# Altium schematic sheet Regulator_Schematic.SchDoc
size A; SheetNumber: 1; SheetTotal: 1
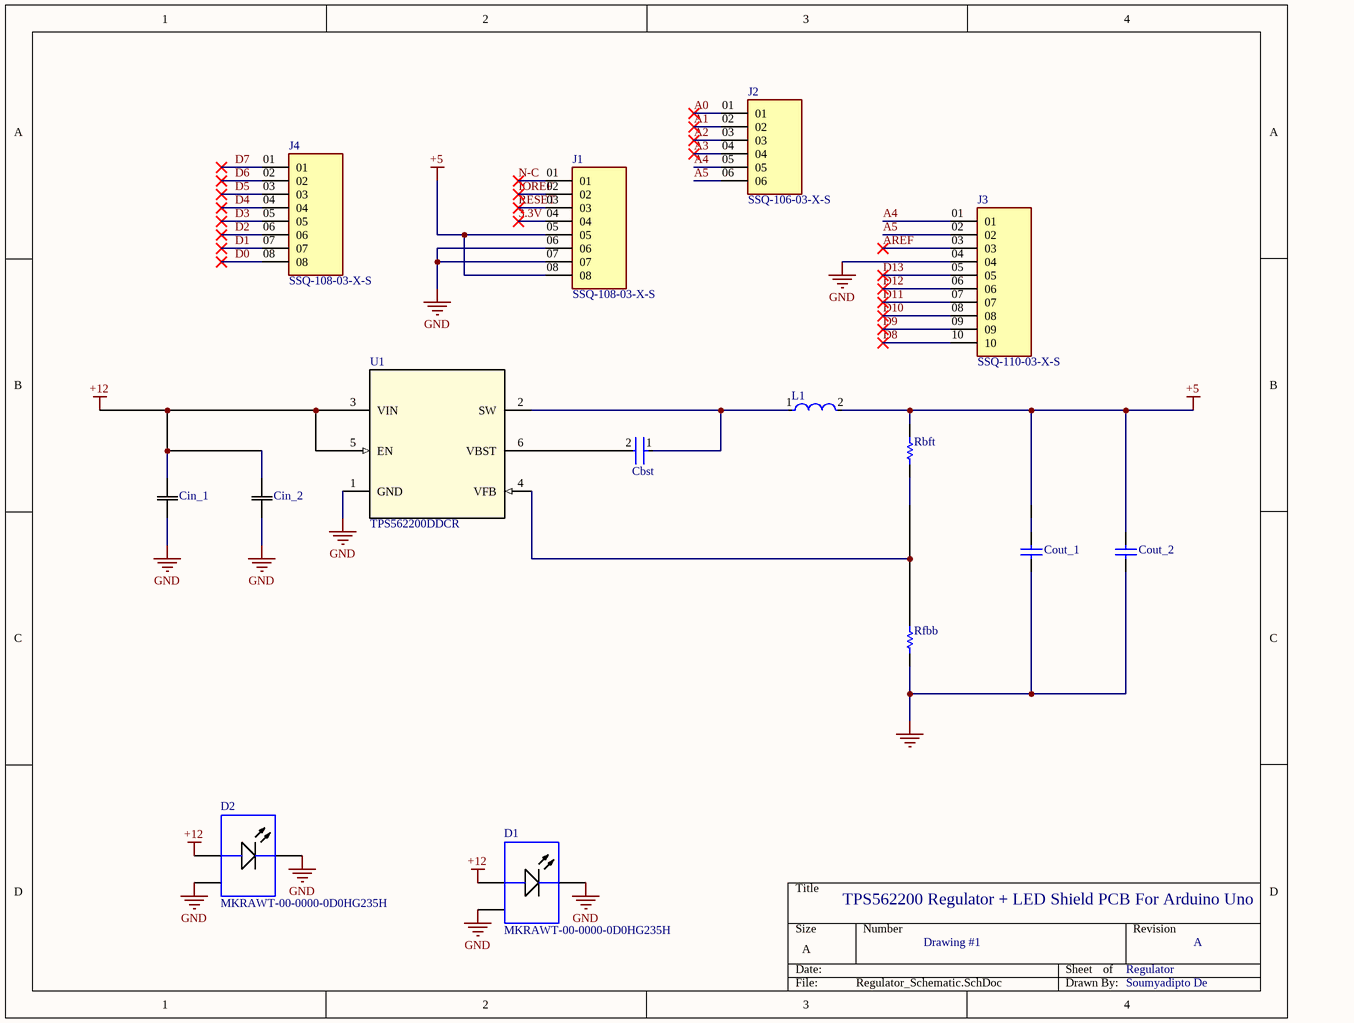
[diagram p0: Regulator_Schematic.SchDoc]

## Parts
Cbst  08053C104KAT2A  [FP-0805-L_2_01_0_2-W_1_25-IPC_C]  (value not drawn)
Cin_1  MSAST219LB5106KTNA01  [CAP_MSAS21-9_TAY]  (value not drawn)
Cin_2  MSAST219LB5106KTNA01  [CAP_MSAS21-9_TAY]  (value not drawn)
Cout_1  C1608X5R1A226M080AC  [CAPC1608X100X20ML10]  (value not drawn)
Cout_2  C1608X5R1A226M080AC  [CAPC1608X100X20ML10]  (value not drawn)
D1  MKRAWT-00-0000-0D0HG235H  [CREE-MK-R-2_V]
D2  MKRAWT-00-0000-0D0HG235H  [CREE-MK-R-2_V]
J1  SSQ-108-03-X-S  [SAMTEC_SSQ-108-03-X-S]
J2  SSQ-106-03-X-S  [SAMTEC_SSQ-106-03-X-S]
J3  SSQ-110-03-X-S  [SAMTEC_SSQ-110-03-X-S]
J4  SSQ-108-03-X-S  [SAMTEC_SSQ-108-03-X-S]
L1  NRS8030T3R3MJGJ  [FP-NRS8030-MFG]  (value not drawn)
Rbft  CRCW020156K2FNED  [RESC0603X28X15NL05T05]  (value not drawn)
Rfbb  ERJ2RKF1002X  [RESC1005X40X25LL05T05]  (value not drawn)
U1  TPS562200DDCR  [DDC0006A]

## Nets
0: Cout_1.1 Cout_2.1 Rfbb.1
+5: Cout_1.2 Cout_2.2 J1.05 J1.08 L1.2 Rbft.2
+12: Cin_1.2 Cin_2.2 D1.1(A) D2.1(A) U1.3(VIN) U1.5(EN)
GND: Cin_1.1 Cin_2.1 D1.2(K) D1.3(EP) D2.2(K) D2.3(EP) J1.06 J1.07 J3.04 U1.1(GND)
3.3V: J1.04
A0: J2.01
A1: J2.02
A2: J2.03
A3: J2.04
A4: J2.05 J3.01
A5: J2.06 J3.02
AREF: J3.03
D0: J4.08
D1: J4.07
D2: J4.06
D3: J4.05
D4: J4.04
D5: J4.03
D6: J4.02
D7: J4.01
D8: J3.10
D9: J3.09
D10: J3.08
D11: J3.07
D12: J3.06
D13: J3.05
IOREF: J1.02
N-C: J1.01
RESET: J1.03
NetCbst_1: Cbst.1 L1.1 U1.2(SW)
NetCbst_2: Cbst.2 U1.6(VBST)
NetRbft_1: Rbft.1 Rfbb.2 U1.4(VFB)

## Notes on the sheet
- TPS562200 Regulator + LED Shield PCB For Arduino Uno
- Drawing #1
- Regulator
- A
- Soumyadipto De

## Library data of the parts
Cbst = CMP-2000-05014-2: General Purpose Ceramic Capacitor, 0805, 100nF, 10%, X7R, 0.15, 25V; Dissipation Factor: 3%; Insulation Resistance: 100GR; Tolerance: 10%; Height: 0.94mm; Case/Package: 0805; Case Code (Imperial): 0805; Number of Pins: 2; Termination: SMD/SMT; Case Code (Metric): 2012; Depth: 1.25mm; Min Operating Temperature: -55°C; Radiation Hardening: No; Max Operating Temperature: 125°C; Length: 2.01mm; Thickness: 0.037inch; Series: -; Dielectric: X7R; Voltage Rating (DC): 25V; Packaging: Tape and Reel; Width: 0.049inch; Capacitance: 100nF; Construction: Flat; Voltage: 25V; RoHS Compliant: Yes; REACH SVHC: No SVHC; Package Quantity: 1; Voltage Rating: 25V; Mount: Surface Mount; Lead Free: Lead Free; Contact Plating: Tin
Cin_1 Cin_2 = MSAST219LB5106KTNA01: No Description Available; Manufacturer_Name: Taiyo Yuden; Copyright: Copyright (C) 2025 Ultra Librarian. All rights reserved.; Manufacturer_Part_Number: MSAST219LB5106KTNA01
Cout_1 Cout_2 = CMP-2000-05441-1: Chip Capacitor, 22 uF, +/- 20%, 10 V, -55 to 85 degC, 0603 (1608 Metric), RoHS, Tape and Reel; Manufacturer: TDK; PCN Part Number: MLCCPartNumberChange30/Nov/2012; Voltage - Rated: 10V; Product Training Modules: CSeriesGeneralApplicationsSEAT,CCV,andTVCLDesignToolsGuidetoReplacinganElectrolyticCapacitorwithanMLCC; Other Names: 445-9077-1; Design Resources: 20WNon-IsolatedBuckLEDDriverUsingPLLNK460KG; Online Catalog: CSeries,GeneralPurpose; Capacitance: 22µF; Temperature Coefficient: X5R; Kits: 445-9014-KIT-ND-KITMLCC100PF-22UF060310-50V; Packaging: CutTape(CT); Standard Package: 1; Package / Case: 0603(1608Metric); Lead Style: -; Features: -; Ratings: -; Operating Temperature: -55degC~85degC; Applications: GeneralPurpose; Package Reference: 603; Datasheet URL: http://download.siliconexpert.com/pdfs/2015/4/21/15/54/45/779/tdk_/manual/37024850441143360mlcc_commercial_general_en.pdf; Datasheet Version: Mar-15; Mounting Type: SurfaceMount,MLCC; Lead Spacing: -; Size / Dimension: 0.063"Lx0.031"W(1.60mmx0.80mm); Height - Seated (Max): -; Package Description: 2-Pin Surface Mount Device, Body 1.6 x 0.8 mm; Manufacturer URL: http://www.tdk.com/; RoHS Information: RoHSCertificate-MLCC; Tolerance: ±20%; Series: C; Thickness (Max): 0.035"(0.90mm); Family: CeramicCapacitors; Category: Capacitors
D1 D2 = CMP-2100-00977-1: LED, White, 12 V, 2-Pin SMD, RoHS, Tape and Reel
J1 J4 = CMP-002-00072-1: SSQ - Samtec 2.54mm Square Tail Single Row Socket Strip 8.5mm Profile - Fast Stock; MP: SSQ-108-03-T-S; Case/Package: None; MF: Samtec; Pins: 8; Source: SSQ-108-03-X-S.SchLib; Component Type: Standard; Design Item ID: SSQ-108-03-X-S; Value: *; Check_prices: https://www.snapeda.com/parts/SSQ-108-03-T-S/Samtec/view-part/?ref=eda; SnapEDA_Link: https://www.snapeda.com/parts/SSQ-108-03-T-S/Samtec/view-part/?ref=snap
J2 = CMP-002-00071-1: SSQ - Samtec 2.54mm Square Tail Single Row Socket Strip 8.5mm Profile - Fast Stock; MP: SSQ-106-03-T-S; MF: Samtec Inc.; Component Type: Standard; SnapEDA_Link: https://www.snapeda.com/parts/SSQ-106-03-T-S/Samtec+Inc./view-part/?ref=snap; Design Item ID: SSQ-106-03-X-S; Source: SSQ-106-03-X-S.SchLib; Pins: 6; Check_prices: https://www.snapeda.com/parts/SSQ-106-03-T-S/Samtec+Inc./view-part/?ref=eda; Case/Package: None; Value: *
J3 = CMP-002-00073-1: 10 Position Receptacle Connector 0.100 (2.54mm) Through Hole Gold; MF: Samtec Inc.; MP: SSQ-110-03-F-S; SnapEDA_Link: https://www.snapeda.com/parts/SSQ-110-03-F-S/Samtec+Inc./view-part/?ref=snap; Check_prices: https://www.snapeda.com/parts/SSQ-110-03-F-S/Samtec+Inc./view-part/?ref=eda; Case/Package: None; Source: SSQ-110-03-X-S.SchLib; Pins: 10; Design Item ID: SSQ-110-03-X-S; Component Type: Standard; Value: *
L1 = CMP-14484-000405-1: Inductor Power Shielded Wirewound 3.3uH 20% 100KHz Ferrite 4.2A 24.7mΩ DCR T/R; Current Rating: 4.3A; DC Resistance (DCR): 19mR; Self Resonant Frequency: 50MHz; Height: 3mm; Lead Free: Lead Free; Saturation Current: 4.2A; Termination: SMD/SMT; RoHS Compliant: Yes; Resistor Type: Wirewound; RMS Current (Irms): 4.3A; Series: NRS; Halogen Free: Halogen Free; Shielding: Shielded; Length: 8mm; Max DC Current: 4.2A; Height - Seated (Max): 0.118inch; Radiation Hardening: No; Min Operating Temperature: -25°C; Number of Pins: 2; Core Material: Ferrite; Inductance: 3.3uH; Package Quantity: 1000; REACH SVHC: No SVHC; Test Frequency: 100kHz; Tolerance: 20%; Case/Package: Nonstandard; Inductance Tolerance: 20%; Width: 0.315inch; Mount: Surface Mount; Depth: 8.2mm; Lead Pitch: 5.6mm; Packaging: Tape and Reel; Max Operating Temperature: 125°C
Rbft = CMP-2004-00723-1: Manufacturer: Vishay Dale; Part Number: CRCW020156K2FNED
Rfbb = CMP-2000-07588-1: Chip Resistor, 10 KOhm, +/- 1%, 0.1 W, -55 to 155 degC, 0402 (1005 Metric), RoHS, Tape and Reel; Manufacturer: Panasonic; Power Rating: 100mW; Voltage Rating: 50V; Resistance: 10KOhm; Case\/Package: 0402; Temperature Coefficient: 100ppm\/degreesC; RoHSCompliant: True; Lead Free: LeadFree; Package Quantity: 1; Contact Plating: Tin; Length: 1mm; Radiation Hardening: No; REACH SVHC: NoSVHC; Max Operating Temperature: 155degC; Depth: 0.5mm; Case Code (Imperial): 0402; Military Standard: Not; Package Description: 2-Pin Surface Mount Device, Body 1 x 0.5 mm; Termination: SMD/SMT; Case Code (Metric): 1005; Height: 0.35mm; Packaging: TapeandReel; Voltage Rating (DC): 50V; Package Reference: 402; Number of Pins: 2; Tolerance: 1%; Mounting Technology: SurfaceMount; Width: 0.02inch; Mount: SurfaceMount; Datasheet URL: https://industrial.panasonic.com/cdbs/www-data/pdf/RDA0000/AOA0000C304.pdf; Composition: ThickFilm; Datasheet Version: 02/2017; Manufacturer URL: http://www.panasonic.com/; Max Power Dissipation: 100mW; Number of Terminations: 2; Min Operating Temperature: -55degC
U1 = TPS562200DDCR: 17 V Input, 2A Synchronous Step-Down Regulator in SOT-23 with Advanced Eco-mode&trade; 6-SOT-23-THIN -40 to 125; Manufacturer_Name: Texas Instruments; Alternate_Manufacturer: None; CurrentTime: Not shown in title block; DocumentNumber: 1; SymbolCreator: a0411947; CompType: IC; U/M: EA; Designator: U?; Copyright: Copyright (C) 2025 Ultra Librarian. All rights reserved.; Manufacturer_Part_Number: TPS562200DDCR; Datasheet: https://www.ti.com/lit/gpn/tps562200; CurrentDate: Not shown in title block; Time: Not shown in title block; Date: Not shown in title block; DocumentFullPathAndName: Not shown in title block; DocumentName: Not shown in title block; ModifiedDate: Not shown in title block; ApprovedBy: Not shown in title block; CheckedBy: Not shown in title block; Author: Not shown in title block; CompanyName: Not shown in title block; Engineer: Not shown in title block; Organization: Not shown in title block; Address1: Not shown in title block; Address2: Not shown in title block; Address3: Not shown in title block; Address4: Not shown in title block; Revision: Use project parameter SCH_Rev; SheetNumber: 1; SheetTotal: 1; ImagePath: Not shown in title block; Rule: *; ProjectName: *; SymbolVersion: 2013-09-26; PartNumber: TPS562200DDC; PackageReference: DDC0006A; MountType: SMT; ComponentLink1Description: Datasheet Link; ComponentLink1URL: https://sps06.itg.ti.com/sites/KMS/crossdivteams/altium/docs/ComponentDatasheets/TPS562200_DS_v08_13_0909.docx; RoHS: Y; Publisher: Texas Instruments; LatestRevisionDate: 2014-02-20; Manufacturer: Texas Instruments; Refdes: Refdes; Type: Type